# EAGLE design ElectroII (UPDATE) (EAGLE 9.6.2)
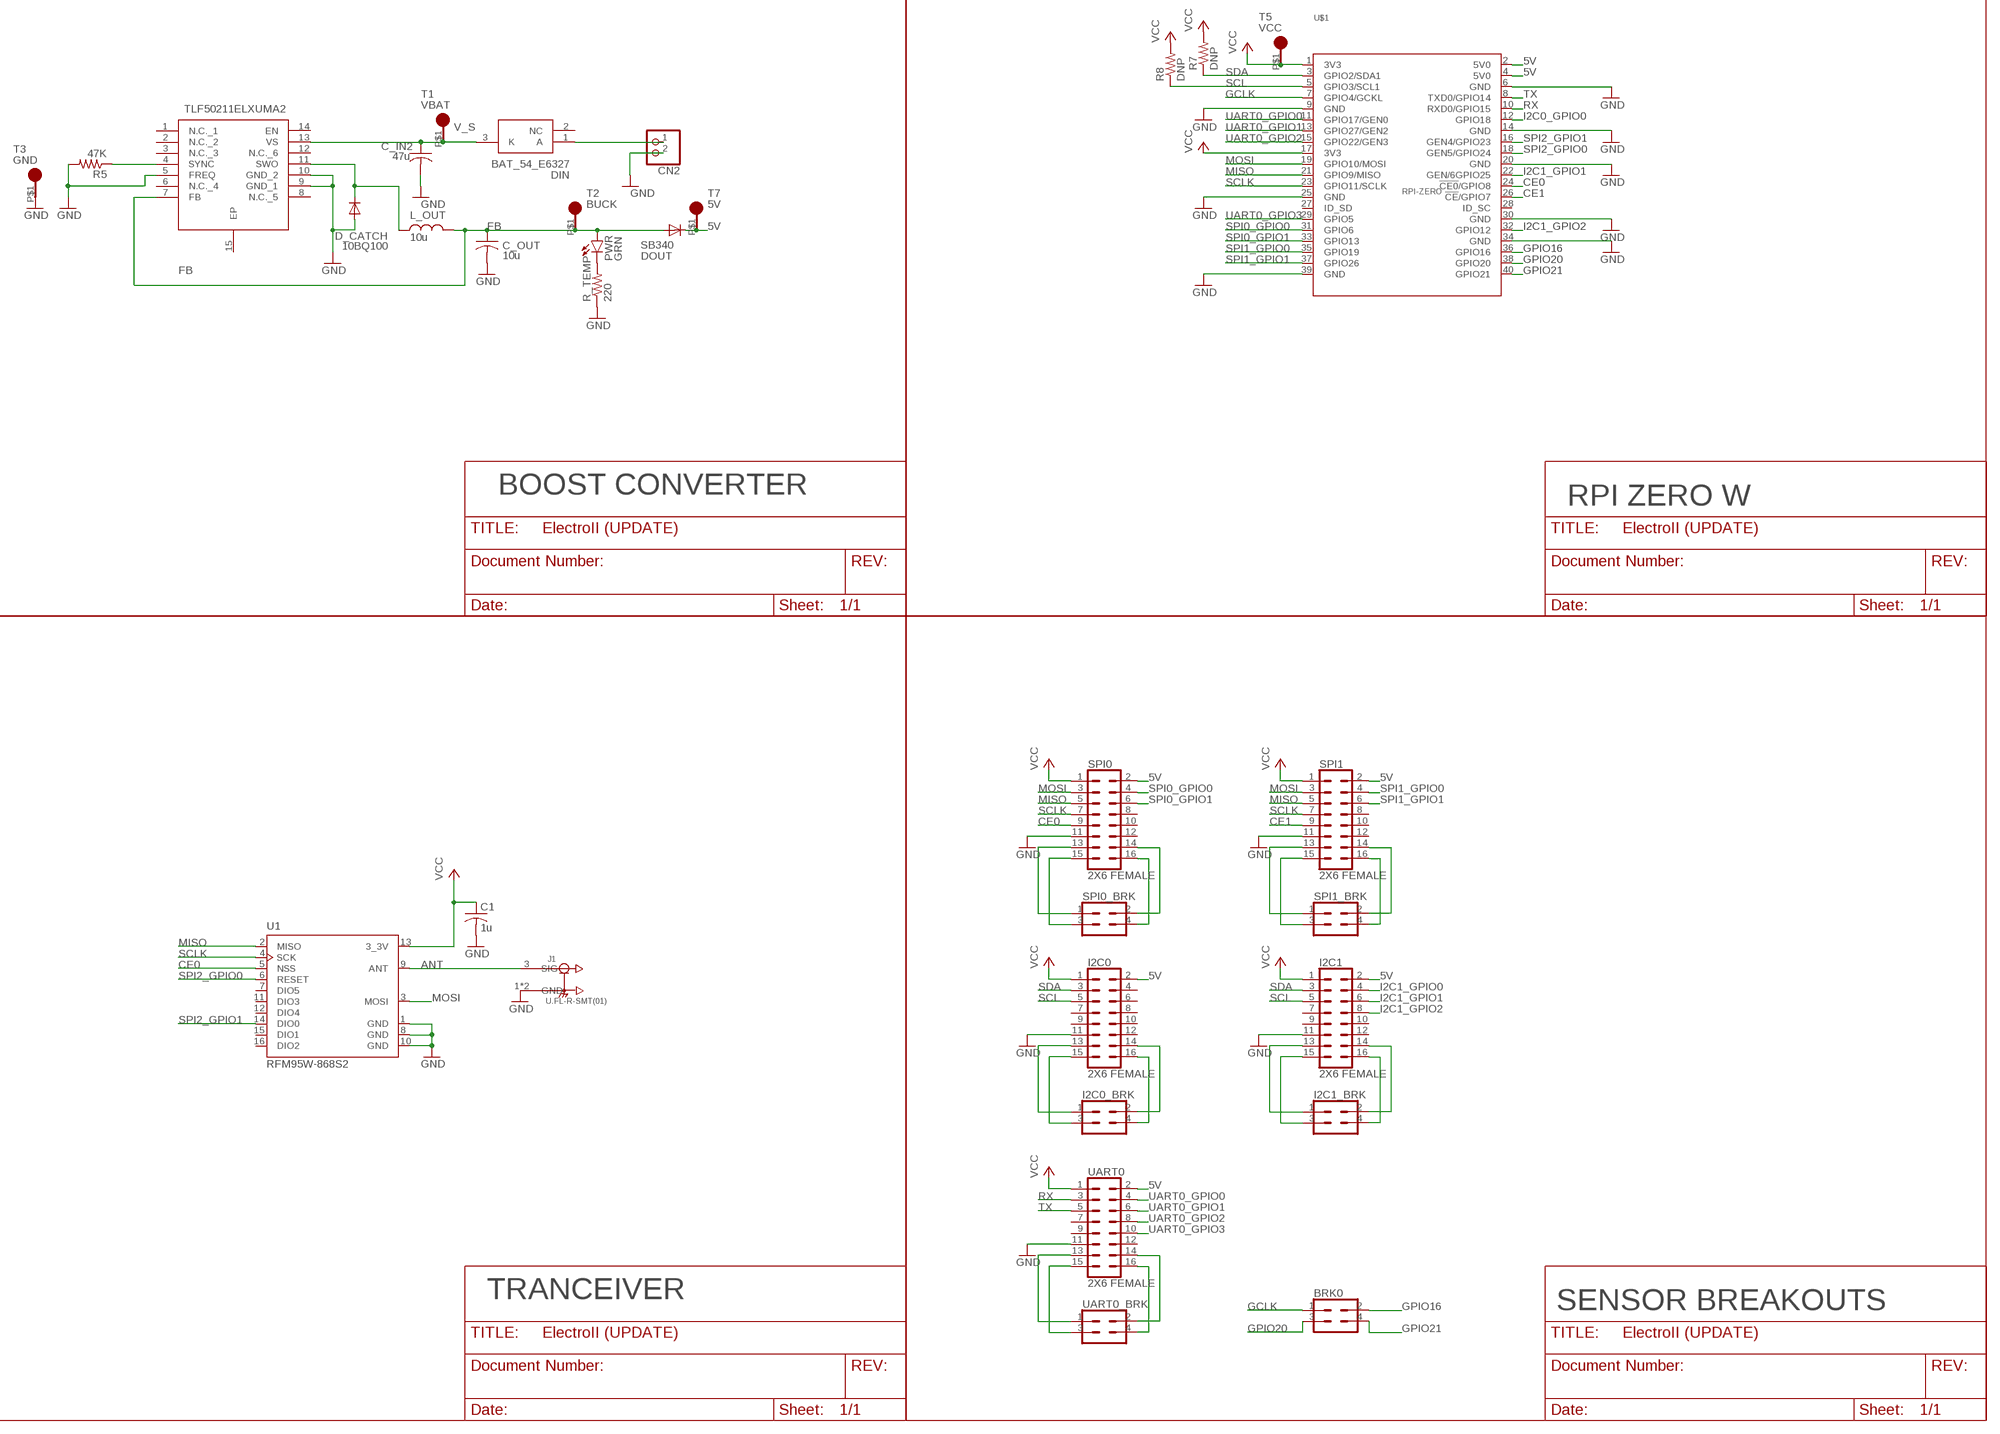
[diagram p0: schematic, sheet 1]

## Parts
BRK0  SENSOR_PIN_BREAKOUT  [2X2]
C1  1u  C-ALL_PACKAGESC1206  [C1206]
C_IN2  47u  C-ALL_PACKAGESC1206  [C1206]
C_OUT  10u  C-ALL_PACKAGESC1206  [C1206]
CN2  JST_2PIN-SMT-RA  [JST-PH-2-SMT-RA]
D_CATCH  10BQ100  1N4004  [DO41-10]
DIN  BAT_54_E6327  [SOT95P240X110-3N]
DOUT  SB340  1N4004  [DO41-10]
I2C0  2X6 FEMALE  SENSOR_BREAKOUTPTH_FEMALE  [2X7]
I2C0_BRK  SENSOR_PIN_BREAKOUT  [2X2]
I2C1  2X6 FEMALE  SENSOR_BREAKOUTPTH_FEMALE  [2X7]
I2C1_BRK  SENSOR_PIN_BREAKOUT  [2X2]
IC1  TLF50211ELXUMA2  [SOP65P600X170-15N]
J1  U.FL-R-SMT(01)  [HRS_U.FL-R-SMT(01)]
L_OUT  10u  L_SMD  [L-DS75LC]
PWR  GRN  LED5MM  [LED5MM]
R5  47K  R-ALL_PACKAGESR1206  [R1206]
R7  DNP  R-ALL_PACKAGESR1206  [R1206]
R8  DNP  R-ALL_PACKAGESR1206  [R1206]
R_TEMP  220  R-ALL_PACKAGESR1206  [R1206]
SPI0  2X6 FEMALE  SENSOR_BREAKOUTPTH_FEMALE  [2X7]
SPI0_BRK  SENSOR_PIN_BREAKOUT  [2X2]
SPI1  2X6 FEMALE  SENSOR_BREAKOUTPTH_FEMALE  [2X7]
SPI1_BRK  SENSOR_PIN_BREAKOUT  [2X2]
T1  VBAT  TEST_PAD  [TEST_PAD]
T2  BUCK  TEST_PAD  [TEST_PAD]
T3  GND  TEST_PAD  [TEST_PAD]
T5  VCC  TEST_PAD  [TEST_PAD]
T7  5V  TEST_PAD  [TEST_PAD]
U1  RFM95W-868S2  [XCVR_RFM95W-868S2]
U$1  RPI-ZERO  [RASP_PI_ZERO_BOARD_FULL]
UART0  2X6 FEMALE  SENSOR_BREAKOUTPTH_FEMALE  [2X7]
UART0_BRK  SENSOR_PIN_BREAKOUT  [2X2]

## Nets
5V [PWR]: DOUT.C I2C0.2 I2C1.2 SPI0.2 SPI1.2 T7.P$1 U$1.2(5V0) U$1.4(5V0) UART0.2
ANT [ANT]: J1.3(SIG) U1.9(ANT)
CE0: SPI0.9 U1.5(NSS) U$1.24(!CE0!/GPIO8)
CE1: SPI1.9 U$1.26(!CE!/GPIO7)
FB: C_OUT.1 DOUT.A IC1.7(FB) L_OUT.P$2 PWR.A T2.P$1
GCLK: BRK0.1 U$1.7(GPIO4/GCKL)
GND [GND]: C1.2 C_IN2.2 C_OUT.2 CN2.2 D_CATCH.A I2C0.11 I2C1.11 IC1.5(FREQ) IC1.9(GND_1) IC1.10(GND_2) J1.1(GND) J1.2(GND) R5.2 R_TEMP.1 SPI0.11 SPI1.11 T3.P$1 U1.1(GND) U1.8(GND) U1.10(GND) U$1.6(GND) U$1.9(GND) U$1.14(GND) U$1.20(GND) U$1.25(GND) U$1.30(GND) U$1.34(GND) U$1.39(GND) UART0.11
GPIO16: BRK0.2 U$1.36(GPIO16)
GPIO20: BRK0.3 U$1.38(GPIO20)
GPIO21: BRK0.4 U$1.40(GPIO21)
I2C0_GPIO0: U$1.12(GPIO18)
I2C1_GPIO0: I2C1.4
I2C1_GPIO1: I2C1.6 U$1.22(GEN/6GPIO25)
I2C1_GPIO2: I2C1.8 U$1.32(GPIO12)
MISO: SPI0.5 SPI1.5 U1.2(MISO) U$1.21(GPIO9/MISO)
MOSI: SPI0.3 SPI1.3 U1.3(MOSI) U$1.19(GPIO10/MOSI)
N$2: CN2.1 DIN.1(A)
N$3: IC1.4(SYNC) R5.1
N$5: PWR.K(C) R_TEMP.2
N$7: SPI0.15 SPI0_BRK.3
N$9: D_CATCH.C IC1.11(SWO) L_OUT.P$1
N$14: SPI0.16 SPI0_BRK.4
N$15: SPI1.13 SPI1_BRK.1
N$20: SPI0.13 SPI0_BRK.1
N$22: SPI1.14 SPI1_BRK.2
N$43: SPI0.14 SPI0_BRK.2
N$44: SPI1.15 SPI1_BRK.3
N$45: SPI1.16 SPI1_BRK.4
N$46: I2C0.13 I2C0_BRK.1
N$52: I2C0.14 I2C0_BRK.2
N$53: I2C0.15 I2C0_BRK.3
N$54: I2C0.16 I2C0_BRK.4
N$55: I2C1.13 I2C1_BRK.1
N$61: I2C1.14 I2C1_BRK.2
N$62: I2C1.15 I2C1_BRK.3
N$63: I2C1.16 I2C1_BRK.4
N$64: UART0.13 UART0_BRK.1
N$70: UART0.14 UART0_BRK.2
N$71: UART0.15 UART0_BRK.3
N$72: UART0.16 UART0_BRK.4
RX: U$1.10(RXD0/GPIO15) UART0.3
SCL: I2C0.5 I2C1.5 R8.1 U$1.5(GPIO3/SCL1)
SCLK: SPI0.7 SPI1.7 U1.4(SCK) U$1.23(GPIO11/SCLK)
SDA: I2C0.3 I2C1.3 R7.1 U$1.3(GPIO2/SDA1)
SPI0_GPIO0: SPI0.4 U$1.31(GPIO6)
SPI0_GPIO1: SPI0.6 U$1.33(GPIO13)
SPI1_GPIO0: SPI1.4 U$1.35(GPIO19)
SPI1_GPIO1: SPI1.6 U$1.37(GPIO26)
SPI2_GPIO0: U1.6(RESET) U$1.18(GEN5/GPIO24)
SPI2_GPIO1: U1.14(DIO0) U$1.16(GEN4/GPIO23)
TX: U$1.8(TXD0/GPIO14) UART0.5
UART0_GPIO0: U$1.11(GPIO17/GEN0) UART0.4
UART0_GPIO1: U$1.13(GPIO27/GEN2) UART0.6
UART0_GPIO2: U$1.15(GPIO22/GEN3) UART0.8
UART0_GPIO3: U$1.29(GPIO5) UART0.10
V_S [PWR]: C_IN2.1 DIN.3(K) IC1.13(VS) T1.P$1
VCC [PWR]: C1.1 I2C0.1 I2C1.1 R7.2 R8.2 SPI0.1 SPI1.1 T5.P$1 U1.13(3_3V) U$1.1(3V3) U$1.17(3V3) UART0.1
Unconnected: DIN.2(NC) I2C0.4 I2C0.6 I2C0.7 I2C0.8 I2C0.9 I2C0.10 I2C0.12 I2C1.7 I2C1.9 I2C1.10 I2C1.12 IC1.1(N.C._1) IC1.2(N.C._2) IC1.3(N.C._3) IC1.6(N.C._4) IC1.8(N.C._5) IC1.12(N.C._6) IC1.14(EN) IC1.15(EP) SPI0.8 SPI0.10 SPI0.12 SPI1.8 SPI1.10 SPI1.12 U1.7(DIO5) U1.11(DIO3) U1.12(DIO4) U1.15(DIO1) U1.16(DIO2) U$1.27(ID_SD) U$1.28(ID_SC) UART0.7 UART0.9 UART0.12

## Notes on the sheet
- BOOST CONVERTER
- RPI ZERO W
- TRANCEIVER
- SENSOR BREAKOUTS

## Library data of the parts
BRK0 I2C0_BRK I2C1_BRK SPI0_BRK SPI1_BRK UART0_BRK = RTR Main Library:SENSOR_PIN_BREAKOUT: 4 pin breakout for connecting any extra wires to a sensor without modifying PCB
C1 C_IN2 C_OUT = RTR Main Library:C-ALL_PACKAGES: CAPACITOR, American symbol
CN2 = adafruit:JST_2PIN: JST 2-Pin Connectors of various flavors SMT-RA (S2B-PH-SM4) 4UConnector #17311 SMT (B2B-PH-SM4) THM-RA (S2B-PH) THM (B2B-PH)
D_CATCH DOUT = adafruit:1N4004: DIODE General purpose 1N400x type rectifier (With bigger pads) http://www.ladyada.net/library/pcb/eaglelibrary.html
DIN = SamacSys_Parts:BAT_54_E6327: Schottky Diodes & Rectifiers 30V 0.2A Source: Datasheet <https://www.mouser.in/datasheet/2/196/Infineon-BAT54SERIES-DS-v01_01-en-1225947.pdf>; DESCRIPTION: Schottky Diodes & Rectifiers 30V 0.2A; HEIGHT: 1.1mm; MANUFACTURER_NAME: Infineon; MANUFACTURER_PART_NUMBER: BAT 54 E6327; MOUSER_PART_NUMBER: 726-BAT54E6327; MOUSER_PRICE-STOCK: https://www.mouser.co.uk/ProductDetail/Infineon-Technologies/BAT-54-E6327?qs=mzcOS1kGbgcJ0DdjiqiVvw%3D%3D
I2C0 I2C1 SPI0 SPI1 UART0 = RTR Main Library:SENSOR_BREAKOUT: .1 inch-spaced 12P sensor breakout Used as a generalized connector for attaching new sensors; PROD_ID: CONN-12423
IC1 = TLF50211ELXUMA2:TLF50211ELXUMA2: Conv DC-DC Single Step-Down Buck 4.75V to 45V 14-Pin PGSSOP EP T/R Source: Datasheet <https://www.infineon.com/dgdl/Infineon-TLF50211EL-DS-v01_10-EN.pdf?fileId=5546d46258fc0bc1015969d2af9641e9>; DESCRIPTION: Conv DC-DC Single Step-Down Buck 4.75V to 45V 14-Pin PGSSOP EP T/R; HEIGHT: 1.7mm; MANUFACTURER_NAME: Infineon; MANUFACTURER_PART_NUMBER: TLF50211ELXUMA2; MOUSER_PART_NUMBER: 726-TLF50211ELXUMA2; MOUSER_PRICE-STOCK: https://www.mouser.co.uk/ProductDetail/Infineon-Technologies/TLF50211ELXUMA2?qs=F5EMLAvA7IBhsauD8F7erw%3D%3D
J1 = RTR Main Library:U.FL-R-SMT(01): U.FL Series 6 Ghz 50 Ohm Ultra-small SMT Coaxial Cable Receptacle; DESCRIPTION: U.FL Series 6 Ghz 50 Ohm Ultra-small SMT Coaxial Cable Receptacle; DIGI-KEY_PART_NUMBER: H9161-ND; DIGI-KEY_PURCHASE_URL: https://www.digikey.com/product-detail/en/hirose-electric-co-ltd/U.FL-R-SMT_01_/H9161-ND/513010?utm_source=snapeda&utm_medium=aggregator&utm_campaign=symbol; MF: Hirose; MP: U.FL-R-SMT_01_; PACKAGE: None
L_OUT = RTR Main Library:L_SMD: SMD Inductor
PWR = RTR Main Library:LED: LED OSRAM: - CHIPLED LG R971, LG N971, LY N971, LG Q971, LY Q971, LO R971, LY R971 LH N974, LH R974 LS Q976, LO Q976, LY Q976 LO Q996 - Hyper CHIPLED LW Q18S LB Q993, LB Q99A, LB R99A - SideLED LS A670, LO A670, LY A670, LG A670, LP A670 LB A673, LV A673, LT A673, LW A673 LH A674 LY A675 LS A676, LA A676, LO A676, LY A676, LW A676 LS A679, LY A679, LG A679 - Hyper Micro SIDELED® LS Y876, LA Y876, LO Y876, LY Y876 LT Y87S - SmartLED LW L88C, LW L88S LB L89C, LB L89S, LG L890 LS L89K, LO L89K, LY L89K LS L896, LA L896, LO L896, LY L896 - TOPLED LS T670, LO T670, LY T670, LG T670, LP T670 LSG T670, LSP T670, LSY T670, LOP T670, LYG T670 LG T671, LOG T671, LSG T671 LB T673, LV T673, LT T673, LW T673 LH T674 LS T676, LA T676, LO T676, LY T676, LB T676, LH T676, LSB T676, LW T676 LB T67C, LV T67C, LT T67C, LS T67K, LO T67K, LY T67K, LW E67C LS E67B, LA E67B, LO E67B, LY E67B, LB E67C, LV E67C, LT E67C LW T67C LS T679, LY T679, LG T679 LS T770, LO T770, LY T770, LG T770, LP T770 LB T773, LV T773, LT T773, LW T773 LH T774 LS E675, LA E675, LY E675, LS T675 LS T776, LA T776, LO T776, LY T776, LB T776 LHGB T686 LT T68C, LB T68C - Hyper Mini TOPLED® LB M676 - Mini TOPLED Santana® LG M470 LS M47K, LO M47K, LY M47K Source: http://www.osram.convergy.de LUXEON: - LUMILED® LXK2-PW12-R00, LXK2-PW12-S00, LXK2-PW14-U00, LXK2-PW14-V00 LXK2-PM12-R00, LXK2-PM12-S00, LXK2-PM14-U00 LXK2-PE12-Q00, LXK2-PE12-R00, LXK2-PE12-S00, LXK2-PE14-T00, LXK2-PE14-U00 LXK2-PB12-K00, LXK2-PB12-L00, LXK2-PB12-M00, LXK2-PB14-N00, LXK2-PB14-P00, LXK2-PB14-Q00 LXK2-PR12-L00, LXK2-PR12-M00, LXK2-PR14-Q00, LXK2-PR14-R00 LXK2-PD12-Q00, LXK2-PD12-R00, LXK2-PD12-S00 LXK2-PH12-R00, LXK2-PH12-S00 LXK2-PL12-P00, LXK2-PL12-Q00, LXK2-PL12-R00 Source: www.luxeon.com KINGBRIGHT: KA-3528ASYC Source: www.kingbright.com
R5 R7 R8 R_TEMP = RTR Main Library:R-ALL_PACKAGES: RESISTOR, American symbol
T1-T3 T5 T7 = RTR Main Library:TEST_PAD: Test pad
U1 = RTR Main Library:RFM95W-868S2: RFM95 Transceiver; AVAILABILITY: Unavailable; MF: RF; MP: RFM95W-868S2; PACKAGE: SMD-16 Hope Microelectronics; PRICE: None
U$1 = rpi-zero:RPI-ZERO

## Net classes
1 PWR: width 0.457 mm, clearance 0.203 mm
2 GND: width 0.508 mm, clearance 0.203 mm
3 ANT: width 0.203 mm, clearance 0.305 mm

## Board
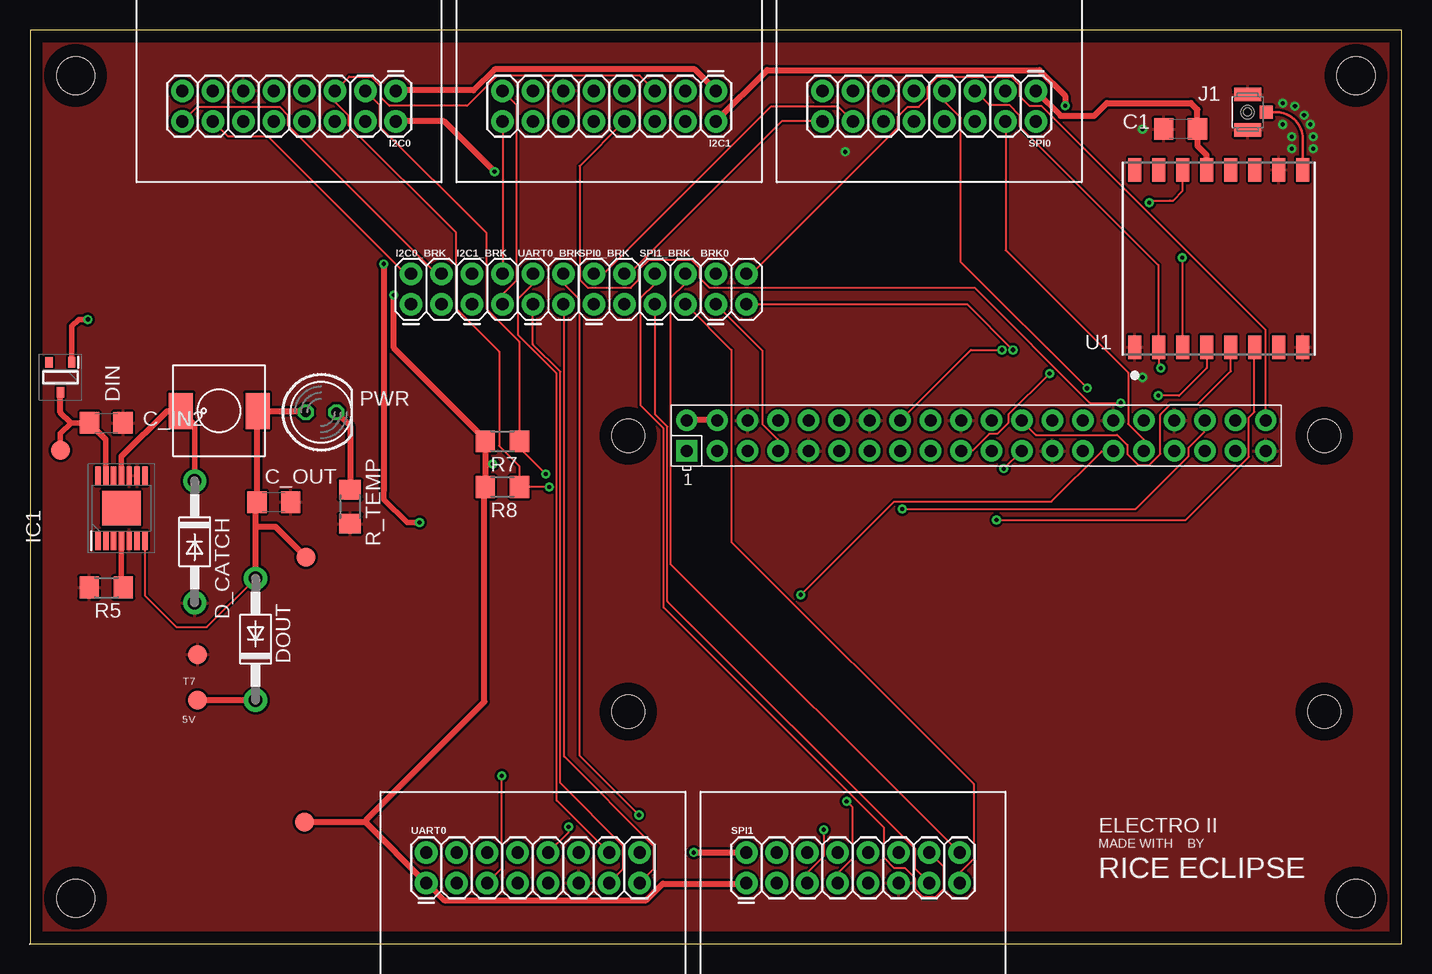
[diagram p1: board, top side]
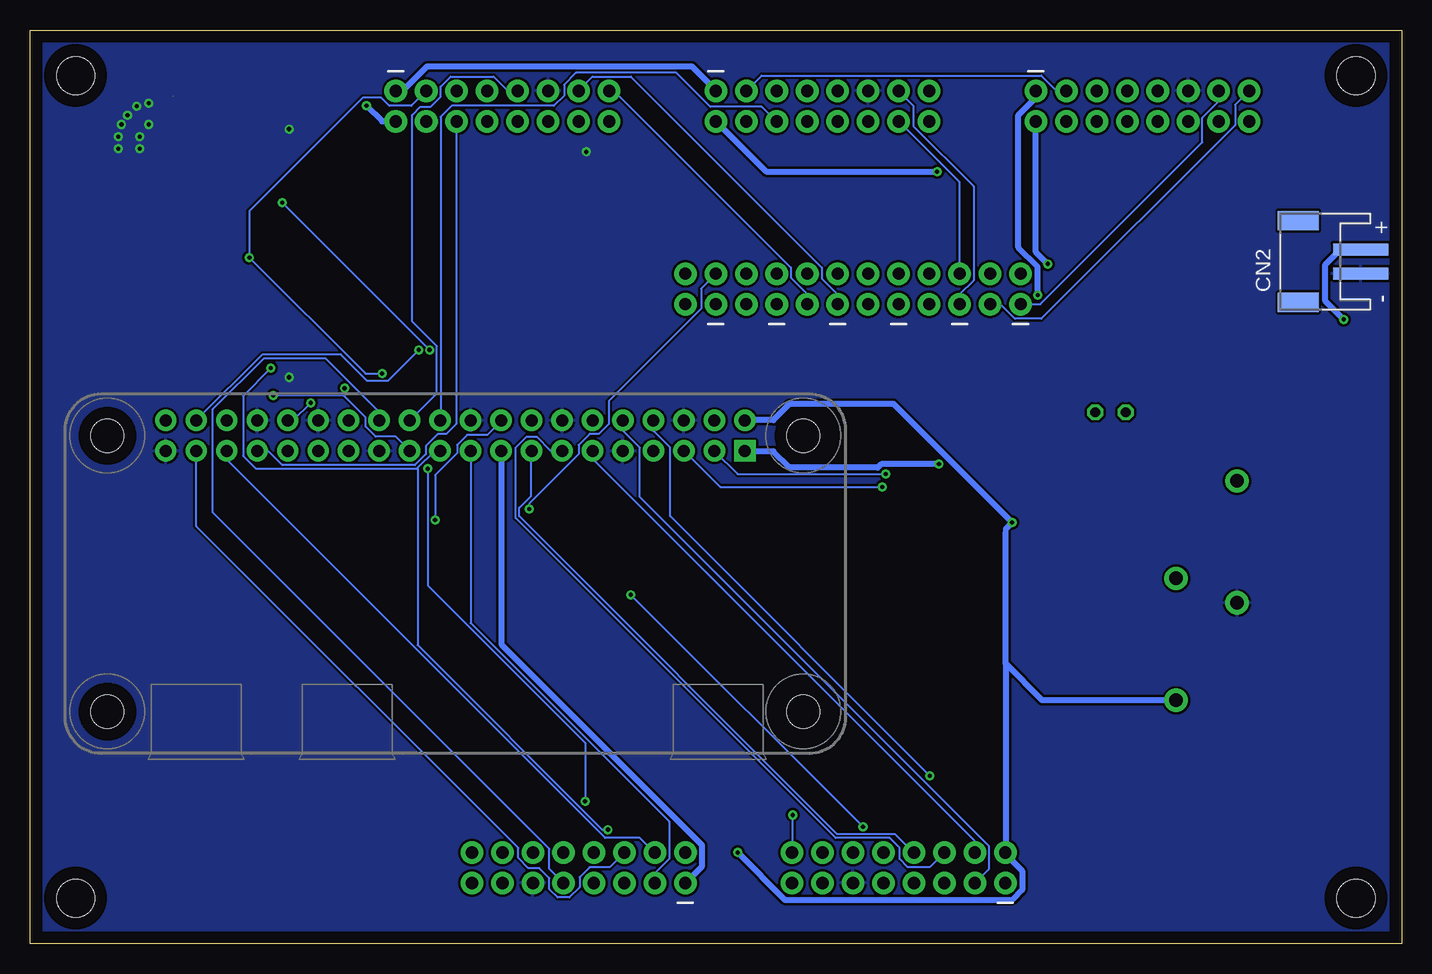
[diagram p2: board, bottom side, seen from below]

Size 114.3 x 76.2 mm. Coordinates in mm from the lower left corner, seen from the top.
Outline: 0,0 114.3,0 114.3,76.2 0,76.2 0,0
Copper layers (1*16): Top 0.035mm / dielectric 1.5mm / Bottom 0.035mm
Design rules "default *": minimum track width 6mil, minimum drill 0.35mm, track to track 6mil, track to pad 6mil, pad to pad 6mil, via to via 6mil, smd to smd 6mil, copper to edge 40mil, drill to drill 6mil, minimum pad ring 10mil, minimum via ring 8mil, stop-mask expansion 4mil, vias tented up to drill 0mil, thermal gap 8mil
Holes 3.17 mm at 3.81,3.81 3.81,72.39 110.49,3.81 110.49,72.39

### Footprints (pad centres in the part's own frame; a part is rotated, then mirrored left to right if it is on the bottom)
2X2 = drill 1.016 pad 1.88: 1 -1.27,-1.27; 2 -1.27,1.27; 3 1.27,-1.27; 4 1.27,1.27
C1206 = smd 1.6 x 1.8: 1 -1.4,0; 2 1.4,0
JST-PH-2-SMT-RA = smd 1 x 4.6: 1 1,-3.7; 2 -1,-3.7 | smd 1.6 x 3.4: NC1 -3.4,1.5; NC2 3.4,1.5
DO41-10 = drill 1.118 pad 1.93: A 5.08,0; C -5.08,0
SOT95P240X110-3N = smd 0.85 x 0.6: 1 -1.25,0.95; 2 -1.25,-0.95; 3 1.25,0
2X7 = drill 1.016 pad 1.88: 1 -8.89,5.08; 2 -8.89,7.62; 3 -6.35,5.08; 4 -6.35,7.62; 5 -3.81,5.08; 6 -3.81,7.62; 7 -1.27,5.08; 8 -1.27,7.62; 9 1.27,5.08; 10 1.27,7.62; 11 3.81,5.08; 12 3.81,7.62; 13 6.35,5.08; 14 6.35,7.62; 15 8.89,5.08; 16 8.89,7.62
SOP65P600X170-15N = smd 1.525 x 0.45: 1 -2.712,1.95; 2 -2.712,1.3; 3 -2.712,0.65; 4 -2.712,0; 5 -2.712,-0.65; 6 -2.712,-1.3; 7 -2.712,-1.95; 8 2.712,-1.95; 9 2.712,-1.3; 10 2.712,-0.65; 11 2.712,0; 12 2.712,0.65; 13 2.712,1.3; 14 2.712,1.95 | smd 2.85 x 3.2: 15 0,0
HRS_U.FL-R-SMT(01) = smd 1.1 x 2.25: 1 -1.475,0; 2 1.475,0 | smd 1.05 x 1.1: 3 0,-1.55
L-DS75LC = smd 2 x 3: P$1 -3.175,0; P$2 3.225,0
LED5MM = drill 0.813 octagon: A -1.27,0; K 1.27,0
R1206 = smd 1.6 x 1.803: 1 -1.422,0; 2 1.422,0
TEST_PAD = smd 1.587 x 1.587: P$1 0,0
XCVR_RFM95W-868S2 = smd 1.95 x 1.05: 1 -7.4,7; 2 -7.4,5; 3 -7.4,3; 4 -7.4,1; 5 -7.4,-1; 6 -7.4,-3; 7 -7.4,-5; 8 -7.4,-7; 9 7.4,-7; 10 7.4,-5; 11 7.4,-3; 12 7.4,-1; 13 7.4,1; 14 7.4,3; 15 7.4,5; 16 7.4,7
RASP_PI_ZERO_BOARD_FULL = drill 1 pad 1.778 square: 1 8.37,25.23 | drill 1 pad 1.778: 2 8.37,27.77; 3 10.91,25.23; 4 10.91,27.77; 5 13.45,25.23; 6 13.45,27.77; 7 15.99,25.23; 8 15.99,27.77; 9 18.53,25.23; 10 18.53,27.77; 11 21.07,25.23; 12 21.07,27.77; 13 23.61,25.23; 14 23.61,27.77; 15 26.15,25.23; 16 26.15,27.77; 17 28.69,25.23; 18 28.69,27.77; 19 31.23,25.23; 20 31.23,27.77; 21 33.77,25.23; 22 33.77,27.77; 23 36.31,25.23; 24 36.31,27.77; 25 38.85,25.23; 26 38.85,27.77; 27 41.39,25.23; 28 41.39,27.77; 29 43.93,25.23; 30 43.93,27.77; 31 46.47,25.23; 32 46.47,27.77; 33 49.01,25.23; 34 49.01,27.77; 35 51.55,25.23; 36 51.55,27.77; 37 54.09,25.23; 38 54.09,27.77; 39 56.63,25.23; 40 56.63,27.77 | hole 2.75: 3.5,3.5; 3.5,26.5; 61.5,3.5; 61.5,26.5

### Placement (x,y rotation side)
BRK0  58.42,54.61 0 top
C1  95.89,67.94 180 top
C_IN2  6.35,43.43 0 top
C_OUT  20.32,36.83 0 top
CN2  7.11,56.9 90 bottom
D_CATCH  13.72,33.53 270 top
DIN  2.54,47.24 270 top
DOUT  18.8,25.4 90 top
I2C0  21.59,76.2 180 top
I2C0_BRK  33.02,54.61 0 top
I2C1  48.26,76.2 180 top
I2C1_BRK  38.1,54.61 0 top
IC1  7.62,36.32 90 top
J1  101.47,69.34 90 top
L_OUT  15.75,44.45 0 top
PWR  24.26,44.32 0 top
R5  6.35,29.72 180 top
R7  39.37,41.91 180 top
R8  39.37,38.1 180 top
R_TEMP  26.67,36.45 90 top
SPI0  74.93,76.2 180 top
SPI0_BRK  48.26,54.61 0 top
SPI1  68.58,0 0 top
SPI1_BRK  53.34,54.61 0 top
T1  2.54,41.15 0 top
T2  22.99,32.26 0 top
T3  13.97,24.13 0 top
T5  22.86,10.16 0 top
T7  13.97,20.32 0 top
U1  99.06,57.15 90 top
U$1  46.35,15.88 0 top
UART0  41.91,0 0 top
UART0_BRK  43.18,54.61 0 top

### Tracks (layer width: path | path; a pad name or v marks a point on that pad's centre or on a via)
5V  (via drill 0.35)
  Top 0.457: 29.49,37.8 29.49,37.06 31.42,35.13 v32.46,35.13
  Top 0.508: I2C0.2 34.52,68.58 v38.71,64.39 | v86.26,69.88 86.26,70.71 84.12,72.85 61.42,72.85 I2C1.2 | U$1.2 54.79,43.66 57.23,43.66 U$1.4 | v55.32,7.62 SPI1.2 | v29.49,56.69 29.49,37.8 | DOUT.C T7.P$1
  Bottom 0.457: 42.37,45.03 v32.46,35.13 32.99,34.59 32.99,34.29
  Bottom 0.508: v38.71,64.39 52.96,64.39 I2C1.2 | SPI0.2 84.96,68.58 v86.26,69.88 | 32.99,23.37 32.99,34.29 | 32.99,23.37 32.99,7.62 UART0.2 32.92,7.39 31.62,6.1 31.62,4.5 32.46,3.66 51.36,3.66 v55.32,7.62 | 42.37,45.03 50.98,45.03 52.35,43.66 54.71,43.66 U$1.2 | I2C0.2 30.48,57.68 v29.49,56.69 | DOUT.C 29.95,20.32 32.99,23.37
ANT
  Top 0.203: U1.9 106.06,67.17 arc90 103.89,69.34 J1.3
CE0
  Top 0.152: 99.82,49.68 100.05,49.68 | 100.05,49.68 U1.5 | U$1.24 82.68,43.59 83.82,42.44 90.6,42.44 91.44,41.6 91.44,40.84 92.35,39.93 93.27,39.93 94.2,40.86 94.2,44.13 95.03,44.96 97.28,44.96 100.08,47.75 100.08,49.66 100.05,49.68
  Bottom 0.152: SPI0.9 73.69,71.17 74.52,71.17 75.67,72.31 79.25,72.31 80.09,71.48 80.09,70.64 80.92,69.8 81.76,69.8 82.45,69.11 82.45,51.89 80.39,49.84 80.39,45.87 82.6,43.66 U$1.24
CE1
  Bottom 0.152: U$1.26 85.27,43.66 85.27,44.42 89.69,48.84 94.79,48.84 99.06,44.58 99.06,35.97 71.02,7.92 71.02,6.25 69.88,5.11 SPI1.9
FB
  Top 0.152: IC1.7 9.57,29.04 12.19,26.42 14.73,26.42 DOUT.A
  Top 0.508: DOUT.A 18.8,34.8 | 18.8,34.8 18.8,36.71 C_OUT.1 18.92,44.4 L_OUT.P$2 22.86,44.45 PWR.A | 18.8,34.8 20.45,34.8 T2.P$1
GCLK
  Top 0.152: BRK0.1 61.04,49.45 61.04,43.36 62.33,42.06 62.33,41.15 U$1.7
GND  (via drill 0.35)
  other vias: 104.39,68.33 105.16,67.31 105.16,66.29 106.93,66.29 106.93,67.31 106.68,68.33 106.17,69.09 105.41,69.85 104.39,70.1 92.71,47.24 92.71,67.94 67.94,66.04
  pour Top (rank 6): -19.05,82.55 -19.05,-25.4 139.7,-25.4 139.7,95.25 101.6,95.25 -19.05,95.25
  pour Bottom (rank 6): -12.7,88.9 -12.7,-19.05 120.65,-19.05 120.65,95.25 107.95,95.25 -12.7,95.25
GPIO16  (via drill 0.35)
  Top 0.152: v72.69,36.27 92.13,36.27 96.55,40.69 96.55,41.38 97.84,42.67 97.84,43.59 U$1.36
  Bottom 0.152: v72.69,36.27 72.69,36.73 68.58,40.84 68.58,41.6 67.67,42.52 66.9,42.52 66.06,43.36 66.06,45.26 58.37,52.96 58.37,54.63 57.15,55.85 BRK0.2
GPIO20  (via drill 0.35)
  Top 0.152: v81.92,49.53 78.11,53.34 59.74,53.34 BRK0.3
  Bottom 0.152: v81.92,49.53 84.51,46.94 86.18,46.94 88.39,49.15 94.94,49.15 100.43,43.66 U$1.38
GPIO21
  Top 0.152: U$1.40 102.95,43.66 102.95,51.21 84.28,69.88 83.29,69.88 82.45,70.71 82.45,71.63 81.76,72.31 75.67,72.31 74.83,71.48 74.83,70.56 74.07,69.8 73.15,69.8 72.31,68.96 72.31,68.05 60.2,55.93 59.74,55.93 BRK0.4
I2C1_GPIO1
  Bottom 0.152: U$1.22 80.09,43.66 80.09,68.96 79.17,69.88 70.64,69.88 69.8,70.71 69.8,71.63 68.81,72.62 60.43,72.62 57.61,69.8 53.34,69.8 52.12,68.58 I2C1.6
I2C1_GPIO2  (via drill 0.35)
  Top 0.152: v90.91,45.11 88.32,45.11 78.72,54.71 56.62,54.71 55.78,55.55 55.78,56.39 55.09,57.07 51.59,57.07 50.75,56.24 50.75,55.4 50.06,54.71 46.48,54.71 45.8,55.4 45.8,64.85 I2C1.8
  Bottom 0.152: v90.91,45.11 92.35,43.66 92.81,43.66 U$1.32
MISO  (via drill 0.35)
  Top 0.152: U1.2 94.03,49.76 94.03,56.62 82.45,68.2 82.45,69.11 81.61,69.95 79.93,69.95 78.79,71.09 SPI0.5 | 94.49,49.3 94.11,49.68 U1.2 | v66.14,9.53 66.14,7.32 64.77,5.94 64.77,5.11 SPI1.5 | U1.2 94.06,48.18 v94.23,48.01
  Bottom 0.152: 82.03,39.66 82.07,39.62 95.48,39.62 96.55,40.69 96.55,45.7 v94.23,48.01 | 82.03,39.66 80.62,41.07 80.16,41.07 U$1.21 | v66.14,9.53 66.6,9.53 81.99,24.92 81.99,39.62 82.03,39.66
MOSI  (via drill 0.35)
  Top 0.152: v96.01,57.23 96.01,49.76 U1.3 | v84.96,47.55 81.53,44.12 81.53,43.43 80.62,42.52 79.93,42.52 78.56,41.15 77.65,41.15 U$1.19
  Bottom 0.152: SPI0.3 81.31,71.09 82.53,69.88 84.35,69.88 85.04,70.56 86.56,70.56 96.01,61.11 v96.01,57.23 86.33,47.55 v84.96,47.55 | SPI1.3 62.18,5.11 62.18,5.94 61.04,7.09 61.04,10.21 77.57,26.75 77.57,41.07 U$1.19
N$2  (via drill 0.35)
  Top 0.457: DIN.1 3.49,51.5 4.06,52.07 v4.83,52.07
  Bottom 0.508: v4.83,52.07 6.35,53.59 6.35,56.64 5.1,57.9 CN2.1
N$3
  Top 0.457: IC1.4 7.62,29.87
  Top 0.508: 7.62,29.87 R5.1
N$5
  Top 0.508: PWR.K 26.67,43.18 R_TEMP.2
N$7
  Bottom 0.152: SPI0_BRK.3 49.53,54.18 50.9,55.55 50.9,56.39 65.61,71.09 65.99,71.09 SPI0.15
N$9
  Top 0.457: D_CATCH.C 13.72,43.31 L_OUT.P$1 11.43,44.45 7.62,40.64 IC1.11
N$14
  Top 0.152: SPI0_BRK.4 49.53,55.93 49.99,55.93 62.64,68.58 65.99,68.58 SPI0.16
N$15
  Top 0.152: SPI1_BRK.1 52.12,53.34 52.12,44.12 53.11,43.13 53.11,28.57 73.76,7.92 73.76,6.25 74.91,5.11 SPI1.13
N$20
  Bottom 0.152: SPI0_BRK.1 47.02,53.34 47.02,54.18 48.31,55.47 48.31,56.39 64.24,72.31 67.44,72.31 68.58,71.17 SPI0.13
N$22
  Top 0.152: SPI1_BRK.2 52.05,55.85 52.05,55.02 50.9,53.87 50.9,44.88 52.81,42.98 52.81,28.04 71.17,9.68 71.17,7.16 72.01,6.33 72.92,6.33 73.76,5.49 73.76,4.57 74.45,3.89 75.44,3.89 76.12,4.57 76.12,6.48 74.98,7.62 SPI1.14
N$43
  Top 0.152: SPI0.14 67.36,69.8 61.72,69.8 47.85,55.93 47.02,55.93 SPI0_BRK.2
N$44
  Top 0.152: SPI1.15 77.5,5.11 77.5,5.94 78.64,7.09 78.64,13.34 58.45,33.53 58.45,49.53 54.63,53.34 SPI1_BRK.3
N$45
  Top 0.152: SPI1_BRK.4 54.56,55.85 54.56,55.02 53.42,53.87 53.42,31.62 77.42,7.62 SPI1.16
N$46
  Bottom 0.152: I2C0.13 15.24,71.09 15.24,70.26 16.61,68.89 16.61,66.83 30.1,53.34 31.7,53.34 I2C0_BRK.1
N$52
  Top 0.152: I2C0.14 16.46,67.36 19.81,67.36 31.24,55.93 31.7,55.93 I2C0_BRK.2
N$53
  Bottom 0.152: I2C0_BRK.3 33.45,53.34 32.23,52.12 30.02,52.12 13.87,68.28 13.87,69.95 12.72,71.09 I2C0.15
N$54
  Top 0.152: I2C0_BRK.4 34.29,55.93 33.83,55.93 21.49,68.28 21.49,69.11 20.8,69.8 13.95,69.8 12.72,68.58 I2C0.16
N$55
  Bottom 0.152: I2C1_BRK.1 36.8,53.34 36.8,54.18 35.66,55.32 35.66,63.17 40.69,68.2 40.69,69.88 41.91,71.09 I2C1.13
N$61
  Bottom 0.152: I2C1.14 36.88,63.55 36.88,55.93 I2C1_BRK.2
N$62
  Top 0.152: I2C1_BRK.3 39.4,53.34 39.4,54.18 40.54,55.32 40.54,69.95 39.4,71.09 I2C1.15
N$63
  Top 0.152: I2C1_BRK.4 39.4,55.93 39.4,68.58 I2C1.16
N$64
  Top 0.152: UART0_BRK.1 41.91,49.99 44.2,47.7 44.2,13.41 49.45,8.15 49.45,6.25 48.31,5.11 UART0.13
N$70
  Top 0.152: UART0_BRK.2 41.91,55.85 41.91,55.02 40.69,53.8 40.69,50.75 43.89,47.55 43.89,11.96 48.23,7.62 UART0.14
N$71
  Top 0.152: UART0_BRK.3 44.5,53.34 44.5,15.62 51.97,8.15 51.97,6.25 50.83,5.11 UART0.15
N$72  (via drill 0.35)
  Top 0.152: v50.75,10.74 45.8,15.7 45.8,53.72 44.5,55.02 44.5,55.85 UART0_BRK.4
  Bottom 0.152: v50.75,10.74 50.75,7.62 UART0.16
RX
  Bottom 0.152: U$1.10 64.85,43.59 64.85,42.75 63.48,41.38 63.48,37.26 34.37,8.15 34.37,6.25 35.51,5.11 UART0.3
SCL  (via drill 0.35)
  Top 0.152: v43.28,38.1 40.84,38.1 R8.1 40.77,38.1 40.77,39.85 39.09,41.53 39.09,49.38 35.51,52.96 35.51,59.28 26.57,68.22 26.57,69.06 25.4,70.23 I2C0.5 26.59,72.31 28.42,72.31 29.26,71.48 29.26,70.56 29.95,69.88 36.42,69.88 38.94,72.39 50.83,72.39 52.05,71.17 I2C1.5
  Bottom 0.152: v43.28,38.1 56.77,38.1 59.74,41.07 U$1.5
SCLK  (via drill 0.35)
  Top 0.152: 97.99,49.68 U1.4 98.06,48.02 95.76,45.72 v94.03,45.72 | v68.05,11.89 68.5,11.43 68.5,7.09 67.36,5.94 67.36,5.11 SPI1.7 | v81.15,39.62 82.6,41.07 U$1.23 | v88.09,46.33 77.57,56.84 77.57,68.89 76.2,70.26 76.2,71.09 SPI0.7
  Bottom 0.152: v94.03,45.72 88.16,45.72 88.12,45.68 | 88.12,45.68 86.33,43.89 86.33,43.13 85.5,42.29 83.82,42.29 82.68,41.15 U$1.23 | v68.05,11.89 68.05,16.76 81.15,29.87 v81.15,39.62 | v88.09,46.33 88.09,45.72 88.12,45.68
SDA  (via drill 0.35)
  Top 0.152: v42.98,39.17 40.84,41.3 40.84,41.91 R7.1 40.77,41.91 40.77,50.22 38.02,52.96 38.02,59.28 29.11,68.2 29.11,69.95 27.96,71.09 I2C0.3
  Bottom 0.152: v42.98,39.17 55.32,39.17 57.23,41.07 U$1.3 | I2C0.3 27.96,71.17 28.8,71.17 30.02,72.39 53.34,72.39 54.56,71.17 I2C1.3
SPI0_GPIO0
  Top 0.152: U$1.31 92.81,41.15 92.81,42.06 91.52,43.36 91.52,47.62 81.31,57.84 81.31,68.58 SPI0.4
SPI0_GPIO1
  Bottom 0.152: U$1.33 95.33,41.07 94.41,41.07 93.27,39.93 82.22,39.93 81.31,40.84 81.31,41.53 80.31,42.52 79.63,42.52 78.79,43.36 78.79,68.58 SPI0.6
SPI1_GPIO0
  Bottom 0.152: U$1.35 97.84,41.07 97.84,40.31 66.37,8.84 63.48,8.84 62.26,7.62 SPI1.4
SPI1_GPIO1
  Bottom 0.152: SPI1.6 65.99,6.4 67.67,6.4 68.5,5.56 68.5,4.72 69.34,3.89 70.33,3.89 71.02,4.57 71.02,5.49 71.86,6.33 72.77,6.33 73.61,7.16 73.61,8 100.43,34.82 100.43,41.07 U$1.37
SPI2_GPIO0  (via drill 0.35)
  Top 0.152: v80.54,35.36 96.32,35.36 101.58,40.62 101.58,43.89 102.03,44.35 102.03,49.68 U1.6
  Bottom 0.152: v80.54,35.36 80.54,39.09 78.72,40.92 78.72,41.6 77.88,42.44 76.2,42.44 75.06,43.59 U$1.18
SPI2_GPIO1  (via drill 0.35)
  Top 0.152: v81,49.53 78.41,49.53 72.54,43.66 U$1.16 | 96.01,64.54 U1.14 96.06,62.79 95.25,61.98 95,61.98 93.45,61.98 v93.27,61.8
  Bottom 0.152: v81,49.53 v93.27,61.8
TX  (via drill 0.35)
  Top 0.152: v39.32,14.02 39.32,6.33 38.1,5.11 UART0.5
  Bottom 0.152: v39.32,14.02 60.96,35.66 60.96,41.38 62.33,42.75 62.33,43.59 U$1.8
UART0_GPIO0
  Bottom 0.152: U$1.11 67.36,41.07 67.36,40.39 35.59,8.61 35.59,7.62 UART0.4
UART0_GPIO1
  Bottom 0.152: UART0.6 39.32,6.4 41.15,6.4 41.83,7.09 41.83,8 42.67,8.84 47.17,8.84 73.84,35.51 73.84,41.38 72.92,42.29 72.08,42.29 70.94,41.15 70.03,41.15 U$1.13
UART0_GPIO2
  Bottom 0.152: U$1.15 72.54,41.07 72.54,37.34 73.53,36.35 73.53,35.66 47.02,9.14 42.22,9.14 40.69,7.62 UART0.8
UART0_GPIO3  (via drill 0.35)
  Top 0.152: v64.24,29.11 72.01,36.88 85.11,36.88 89.31,41.07 90.22,41.07 U$1.29 | v44.88,9.75 44.88,9.3 43.2,7.62 UART0.10
  Bottom 0.152: v44.88,9.75 v64.24,29.11
V_S
  Top 0.457: T1.P$1 2.54,42.55 3.43,43.43 C_IN2.1 6.32,42.06 IC1.13
  Top 0.508: 3.43,43.43 2.54,44.32 DIN.3
VCC  (via drill 0.35)
  Top 0.508: 97.99,64.62 U1.13 98.06,65.77 97.31,66.52 97.31,67.89 C1.1 97.28,69.57 96.75,70.1 89.74,70.1 88.67,69.04 85.88,69.04 83.82,71.09 SPI0.1 | I2C0.1 30.48,71.17 36.96,71.17 38.71,72.92 55.4,72.92 57.15,71.17 I2C1.1 | R7.2 37.95,40.01 | 37.95,40.01 R8.2 | R8.2 | R7.2 | 27.96,10.13 22.86,10.13 T5.P$1 | 27.96,10.13 32.99,5.11 UART0.1 33.22,4.95 34.52,3.66 51.36,3.66 52.73,5.03 59.66,5.03 SPI1.1 | R8.2 37.87,37.87 37.87,20.19 28.04,10.36 27.96,10.13 | v38.56,40.01 38.18,40.01 37.95,40.01 | v30.33,54.1 30.33,49.68 37.87,42.14 R7.2
  Bottom 0.508: SPI0.1 83.82,71.17 83.21,71.17 81.23,73.15 59.13,73.15 57.15,71.17 I2C1.1 | U$1.17 74.98,41.07 74.98,24.92 58.29,8.23 58.29,6.48 59.66,5.11 SPI1.1 | v38.56,40.01 43.36,40.01 43.66,39.7 50.98,39.7 52.35,41.07 54.71,41.07 U$1.1 | v30.33,54.1 30.33,56.46 31.93,58.06 31.93,69.11 30.48,70.56 30.48,71.09 I2C0.1

### Text on the board
tPlace: ELECTRO II | MADE WITH BY | ♥ | RICE ECLIPSE
Drills: 2021